# Altium project CH32V003F4P6_ControlRelay.PrjPcb
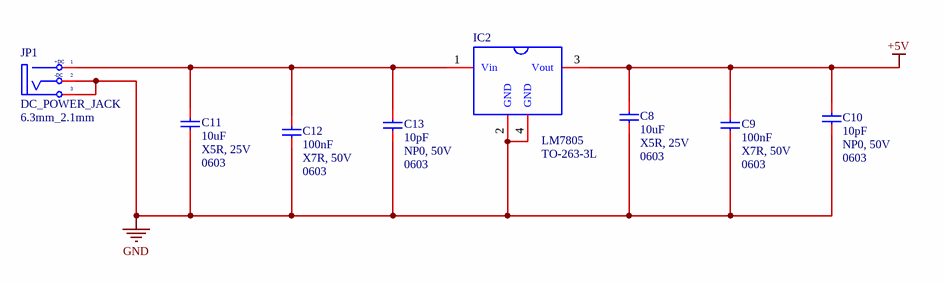
[diagram p0: POWER_SUPPLY.SchDoc]
5 sheets, 62 parts. Net scope: global (net labels, ports and power ports of the same name join across sheets).
Board files: PCB_V1.0.PcbDoc, Multi_Board_V1.0.PcbDoc
Sheets:
  REVISION_HISTORY.SchDoc
  POWER_SUPPLY.SchDoc
  MCU.SchDoc
  DS1307.SchDoc
  RELAY.SchDoc

## Sheet REVISION_HISTORY.SchDoc: REVISIONS HISTORY
size A3; SheetNumber: 1; SheetTotal: 5

### Notes on the sheet
- TABLES OF CONTENTS
- REVISION HISTORY
- PAGE
- CONTENTS
- VER#
- DATE
- REVISIONS
- DESCRIPTION OF CHANGES
- AUTHOR
- Author:
- Title:
- Size:
- A3
- Project:
- Revision:
- Modified Date:
- CheckedBy:
- Date:
- SW Version:

## Sheet POWER_SUPPLY.SchDoc: POWER_SUPPLY
size A4; Author: NGUYEN QUANG MINH; Organization: My Company; Address1: Address Line 1; Address2: Address Line 2; Address3: Address Line 3; Address4: Address Line 4; SheetNumber: 2; SheetTotal: 5

### Parts
C8  10uF  Temperature Coefficient: X5R, 25V  Package: 0603  [C0603]
C9  100nF  Temperature Coefficient: X7R, 50V  Package: 0603  [C0603]
C10  10pF  Temperature Coefficient: NP0, 50V  Package: 0603  [C0603]
C11  10uF  Temperature Coefficient: X5R, 25V  Package: 0603  [C0603]
C12  100nF  Temperature Coefficient: X7R, 50V  Package: 0603  [C0603]
C13  10pF  Temperature Coefficient: NP0, 50V  Package: 0603  [C0603]
IC2  LM7805  [TO-263-3L]
JP1  DC_POWER_JACK  Reference: 6.3mm_2.1mm  [DC_POWER_JACK_6.3mm_2.1mm]

### Nets
+5V: C8.2 C9.2 C10.2 IC2.3(Vout)
GND: C8.1 C9.1 C10.1 C11.1 C12.1 C13.1 IC2.2(GND) IC2.4(GND) JP1.2(TN) JP1.3(S)
NetC11_2: C11.2 C12.2 C13.2 IC2.1(Vin) JP1.1(T)

### Notes on the sheet
- Author:
- Title:
- Size:
- A4
- Project:
- Approved:
- Revision:
- Modified Date:
- CONFIDENTIAL
- Date:
- SW Version:
- (in symbol DC_POWER_JACK_6.3mm_2.1mm) +DC; -DC

### Library data of the parts
C8 C11 = C0603_MLCC_10uF_X5R_25V: 25V 10uF X5R ±20% 0603 Multilayer Ceramic Capacitors MLCC - SMD/SMT ROHS; Manufacturer: YAGEO; Mfr. Part: CC0603MRX5R8BB106; LCSC Part: C596327; Capacitance: 10uF; Link: https://www.lcsc.com/product-detail/C596327.html; Tolerance: ±20%; Voltage Rating: 25V
C9 C12 = C0603_MLCC_100nF_X7R_50V: 50V 100nF X7R ±10% 0603 Multilayer Ceramic Capacitors MLCC - SMD/SMT ROHS; Manufacturer: YAGEO; Mfr. Part: CC0603KRX7R9BB104; LCSC Part: C14663; Capacitance: 100nF; Link: https://www.lcsc.com/product-detail/C14663.html; Tolerance: ±10%; Voltage Rating: 50V
C10 C13 = C0603_MLCC_10pF_NP0_50V: 50V 10pF NP0 ±5% 0603 Multilayer Ceramic Capacitors MLCC - SMD/SMT ROHS; Manufacturer: YAGEO; Mfr. Part: CC0603JRNPO9BN100; LCSC Part: C106245; Capacitance: 10pF; Link: https://www.lcsc.com/product-detail/C106245.html; Tolerance: ±5%; Voltage Rating: 50V
IC2 = LM7805_TO-263-3L: 62dB@(120Hz) 1A Fixed 4.8V~5.2V Positive 35V TO-263-3L Voltage Regulators - Linear, Low Drop Out (LDO) Regulators ROHS; Manufacturer: HANSCHIP semiconductor; Mfr. Part: LM7805SRG; Number of Outputs: 1; LCSC Part: C5145372; Link: https://www.lcsc.com/product-detail/C5145372.html?s_z=n_lm7805; Category: Power Management (PMIC)/Voltage Regulators - Linear, Low Drop Out (LDO) Regulators; Output Current: 1A; Output Voltage: 4.8V~5.2V; Output Configuration: Positive; Operating Temperature: -40℃~+85℃@(Ta); Voltage - Supply: 35V; Package: TO-263-3L
JP1 = DC_POWER_JACK_6.3mm_2.1mm: Right Angle DC Power Jack -40℃~+85℃ 2.1mm 6.3mm 3A 500V Through Hole DC Power Connectors ROHS; Manufacturer: Lian Xin Technology; Mfr. Part: XDJK-0051-025; LCSC Part: C7498153; Package: Through Hole; Current Rating-Power: 3A; Link: https://www.lcsc.com/product-detail/C7498153.html?s_z=n_XDJK-0051-025; Connector Type: DC Power Jack; Operating Temperature: -40℃~+85℃; Inside Contact Diameter: 2.1mm; Outside Contact Diameter: 6.3mm; Current Rating: 3A; Voltage Rating (Max): 500V

## Sheet MCU.SchDoc: MCU
size A4; Author: NGUYEN QUANG MINH; Organization: My Company; Address1: Address Line 1; Address2: Address Line 2; Address3: Address Line 3; Address4: Address Line 4; SheetNumber: 3; SheetTotal: 5
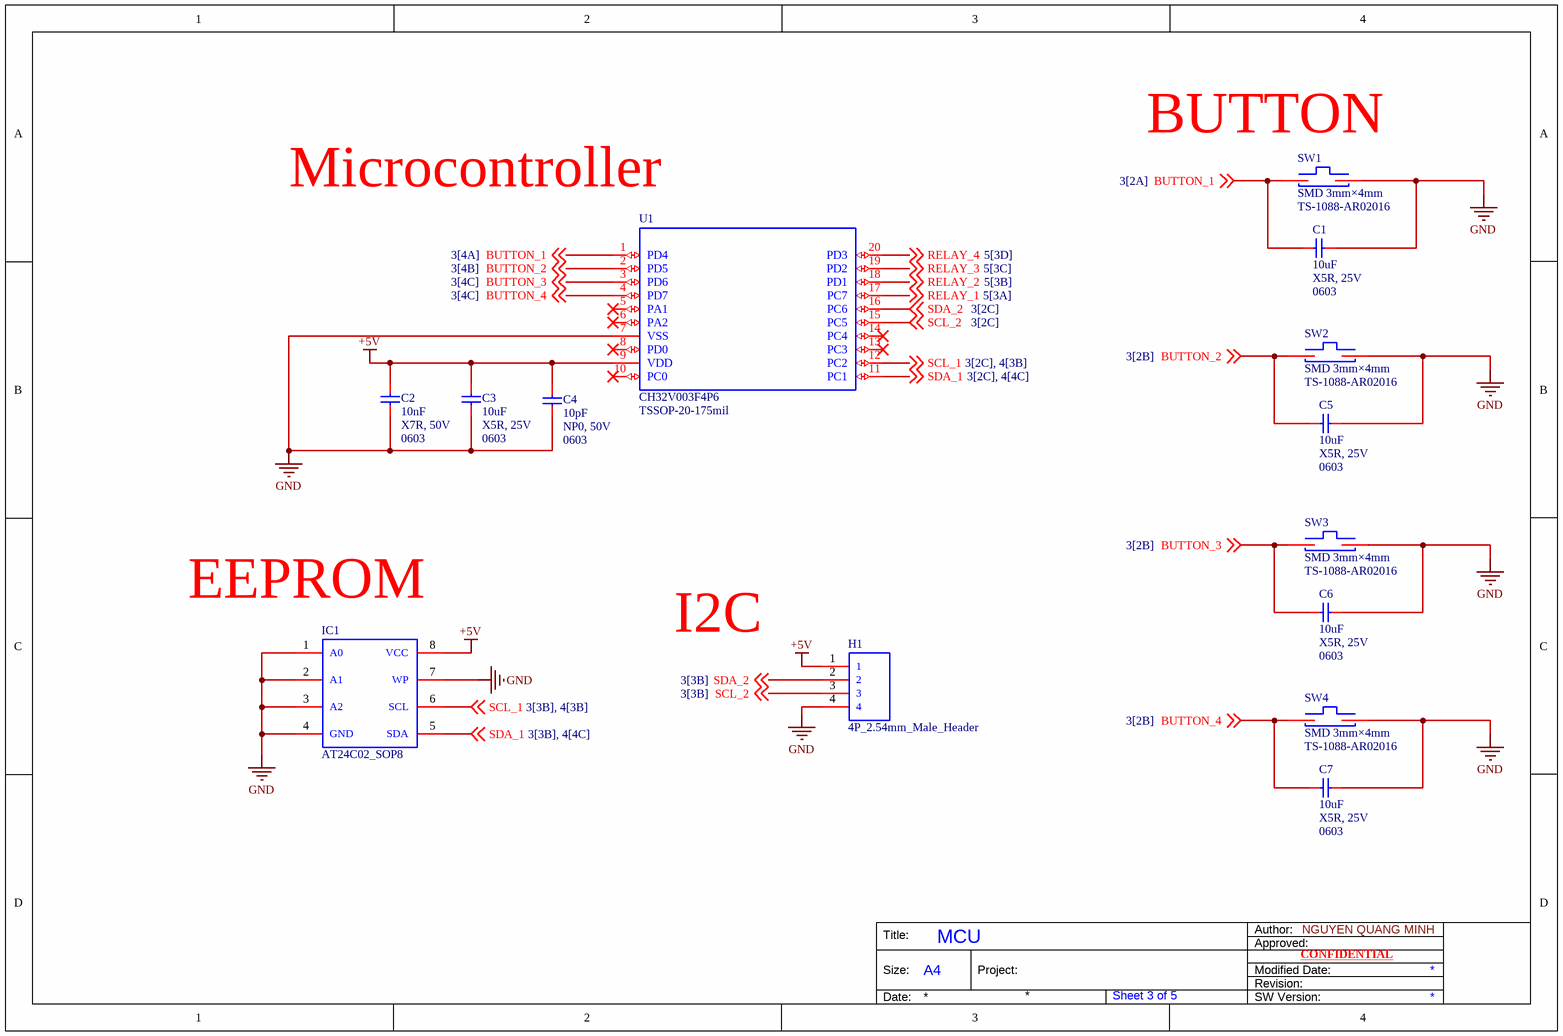
[diagram p1: MCU.SchDoc]

### Parts
C1  10uF  Temperature Coefficient: X5R, 25V  Package: 0603  [C0603]
C2  10nF  Temperature Coefficient: X7R, 50V  Package: 0603  [C0603]
C3  10uF  Temperature Coefficient: X5R, 25V  Package: 0603  [C0603]
C4  10pF  Temperature Coefficient: NP0, 50V  Package: 0603  [C0603]
C5  10uF  Temperature Coefficient: X5R, 25V  Package: 0603  [C0603]
C6  10uF  Temperature Coefficient: X5R, 25V  Package: 0603  [C0603]
C7  10uF  Temperature Coefficient: X5R, 25V  Package: 0603  [C0603]
H1  4P_2.54mm_Male_Header  [4P, 2,54mm, MALE HEADER]
IC1  AT24C02_SOP8  [SOP-8]
SW1  SMD 3mm×4mm  Mfr. Part: TS-1088-AR02016  [ROUND_BUTTON_SMD 3*4mm]
SW2  SMD 3mm×4mm  Mfr. Part: TS-1088-AR02016  [ROUND_BUTTON_SMD 3*4mm]
SW3  SMD 3mm×4mm  Mfr. Part: TS-1088-AR02016  [ROUND_BUTTON_SMD 3*4mm]
SW4  SMD 3mm×4mm  Mfr. Part: TS-1088-AR02016  [ROUND_BUTTON_SMD 3*4mm]
U1  CH32V003F4P6  Package: TSSOP-20-175mil  [TSSOP-20]

### Nets
+5V: C2.2 C3.2 C4.2 H1.1 IC1.8(VCC) U1.9(VDD)
GND: C1.2 C2.1 C3.1 C4.1 C5.2 C6.2 C7.2 H1.4 IC1.1(A0) IC1.2(A1) IC1.3(A2) IC1.4(GND) IC1.7(WP) SW1.2 SW2.2 SW3.2 SW4.2 U1.7(VSS)
BUTTON_1: C1.1 SW1.1 U1.1(PD4) ; off-sheet BUTTON_1
BUTTON_2: C5.1 SW2.1 U1.2(PD5) ; off-sheet BUTTON_2
BUTTON_3: C6.1 SW3.1 U1.3(PD6) ; off-sheet BUTTON_3
BUTTON_4: C7.1 SW4.1 U1.4(PD7) ; off-sheet BUTTON_4
RELAY_1: U1.17(PC7) ; off-sheet RELAY_1
RELAY_2: U1.18(PD1) ; off-sheet RELAY_2
RELAY_3: U1.19(PD2) ; off-sheet RELAY_3
RELAY_4: U1.20(PD3) ; off-sheet RELAY_4
SCL_1: IC1.6(SCL) U1.12(PC2) ; off-sheet SCL_1
SCL_2: H1.3 U1.15(PC5) ; off-sheet SCL_2
SDA_1: IC1.5(SDA) U1.11(PC1) ; off-sheet SDA_1
SDA_2: H1.2 U1.16(PC6) ; off-sheet SDA_2

Not connected (* = marked no-connect by the designer): U1 5(PA1)* 6(PA2)* 8(PD0)* 10(PC0)* 13(PC3)* 14(PC4)*

### Notes on the sheet
- (near SW1) BUTTON
- Microcontroller
- (near IC1) EEPROM
- I2C
- Author:
- Title:
- Size:
- A4
- Project:
- Approved:
- Revision:
- Modified Date:
- CONFIDENTIAL
- Date:
- SW Version:

### Library data of the parts
C1 C3 C5-C7 = C0603_MLCC_10uF_X5R_25V: as C8 on sheet POWER_SUPPLY; LCSC Part: C596327; Capacitance: 10uF; Link: https://www.lcsc.com/product-detail/C596327.html; Tolerance: ±20%; Voltage Rating: 25V
C2 = C0603_MLCC_10nF_X7R_50V: 50V 10nF X7R ±10% 0603 Multilayer Ceramic Capacitors MLCC - SMD/SMT ROHS; Manufacturer: YAGEO; Mfr. Part: CC0603KRX7R9BB103; LCSC Part: C100042; Capacitance: 10nF; Link: https://www.lcsc.com/product-detail/C100042.html; Tolerance: ±10%; Voltage Rating: 50V
C4 = C0603_MLCC_10pF_NP0_50V: as C10 on sheet POWER_SUPPLY; LCSC Part: C106245; Capacitance: 10pF; Link: https://www.lcsc.com/product-detail/C106245.html; Tolerance: ±5%; Voltage Rating: 50V
H1 = 4P_2.54mm_Male_Header: 4P 1x4P -40℃~+105℃ Black Pin Header 2.54mm 2.5mm 6mm 250V 3mm 1 Through Hole Through Hole,P=2.54mm Headers, Male Pins ROHS; Manufacturer: XFCN; Mfr. Part: PZ254V-11-04P; LCSC Part: C2691448; Package: Through Hole,P=2.54mm; Holes Structure: 1x4P; Link: https://www.lcsc.com/product-detail/C2691448.html; Pitch: 2.54mm
IC1 = AT24C02_SOP8: 2Kbit 1.8V~5.5V 1MHz I2C SOP-8 Memory (ICs) ROHS; Manufacturer: IDCHIP; Key Attributes: 24C02 2K-bit Electrically Erasable PROM; Data Retention - TDR (Year): 100 Years; Write Cycle Time(tWC): 5ms; Write Cycle Endurance: 1,000,000 Cycles; Mfr. Part: AT24C02; LCSC Part: C688857; Package: SOP-8; Memory Size: 2Kbit; Voltage - Supply: 1.8V~5.5V; Clock Frequency: 1MHz; Operating Temperature: -40℃~+85℃; Interface: I2C; Link: https://www.lcsc.com/product-detail/C688857.html?s_z=n_AT24C02%2520-%2520TSSOP8
SW1-SW4 = SW_BUTTON_SMD_3mm×4mm: Without Bracket 50mA 4mm 100,000 Cycles 12V 1.6N 3mm 2mm Round Button Surface Mount,Vertical SPST SMD Tactile Switches ROHS; Manufacturer: XUNPU; LCSC Part: C720477; Package: SMD; Length: 4mm; Width: 3mm; Voltage Rating: 12V; Operating Temperature: -30℃~+80℃; Link: https://www.lcsc.com/product-detail/C720477.html?s_z=n_Button
U1 = CH32V003F4P6_TSSOP-20-175mil: TSSOP-20-175mil Microcontrollers (MCU/MPU/SOC) ROHS; Manufacturer: WCH; Mfr. Part: CH32V003F4P6; LCSC Part: C5187096; Link: https://www.lcsc.com/product-detail/C5187096.html?s_z=n_CH32V003F4P6

## Sheet DS1307.SchDoc
size A4; Organization: My Company; Address1: Address Line 1; Address2: Address Line 2; Address3: Address Line 3; Address4: Address Line 4; SheetNumber: 4; SheetTotal: 5
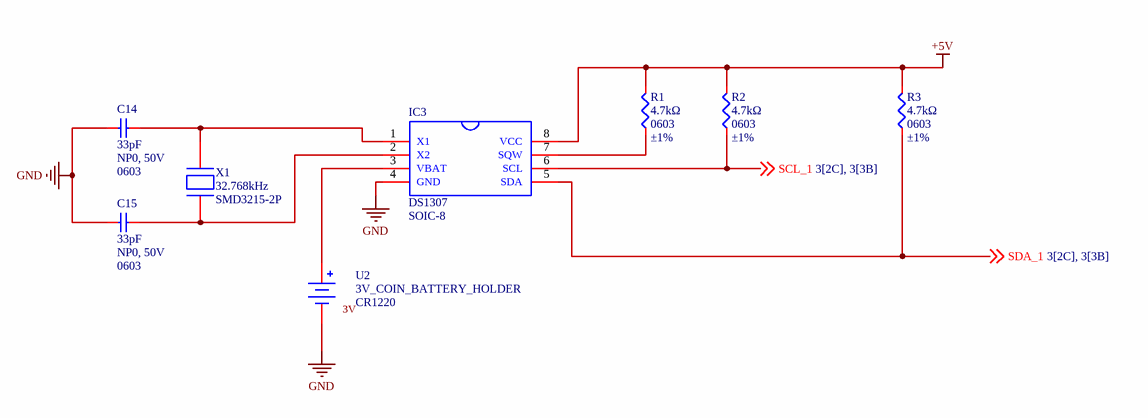
[diagram p2: DS1307.SchDoc]

### Parts
C14  33pF  Temperature Coefficient: NP0, 50V  Package: 0603  [C0603]
C15  33pF  Temperature Coefficient: NP0, 50V  Package: 0603  [C0603]
IC3  DS1307  [SOIC-8]
R1  4.7kΩ  Package: 0603  Tolerance: ±1%  [R0603]
R2  4.7kΩ  Package: 0603  Tolerance: ±1%  [R0603]
R3  4.7kΩ  Package: 0603  Tolerance: ±1%  [R0603]
U2  3V_COIN_BATTERY_HOLDER  Battery Type: CR1220  [3V_COIN_BATERRY_HOLDER_CR1220]
X1  32.768kHz  [SMD3215-2P]

### Nets
+5V: IC3.8(VCC) R1.2 R2.2 R3.2
GND: C14.2 C15.2 IC3.4(GND) U2.2
SCL_1: IC3.6(SCL) R2.1 ; off-sheet SCL_1
SDA_1: IC3.5(SDA) R3.1 ; off-sheet SDA_1
NetC14_1: C14.1 IC3.1(X1) X1.2
NetC15_1: C15.1 IC3.2(X2) X1.1
NetIC3_3: IC3.3(VBAT) U2.1
NetIC3_7: IC3.7(SQW) R1.1

### Notes on the sheet
- Author:
- Title:
- Size:
- A4
- Project:
- Approved:
- Revision:
- Modified Date:
- CONFIDENTIAL
- Date:
- SW Version:
- (in symbol 3V_COIN_BATTERY_HOLDER) 3V

### Library data of the parts
C14 C15 = C0603_MLCC_33pF_NP0_50V: 50V 33pF NP0 ±5% 0603 Multilayer Ceramic Capacitors MLCC - SMD/SMT ROHS; Manufacturer: YAGEO; Mfr. Part: CC0603JRNPO9BN330; LCSC Part: C107047; Capacitance: 33pF; Link: https://www.lcsc.com/product-detail/C107047.html; Tolerance: ±5%; Voltage Rating: 50V
IC3 = DS1307-SOIC8: I2C SOIC-8 Real Time Clocks ROHS; Manufacturer: MAXIM; Mfr. Part: DS1307Z+T&R; Key Attributes: 64 x 8, Serial, I²C Real-Time Clock; LCSC Part: C9868; Link: https://www.lcsc.com/product-detail/C9868.html?s_z=n_DS1307; Interface: I2C; Package: SOIC-8
R1-R3 = R0603_4.7kΩ_±1%: 100mW Thick Film Resistor 75V ±100ppm/℃ ±1% 4.7kΩ 0603 Chip Resistor - Surface Mount ROHS; Manufacturer: YAGEO; Mfr. Part: RC0603FR-074K7L; LCSC Part: C99782; Resistance: 4.7kΩ; Operating Temperature: -55℃~+155℃; Link: https://www.lcsc.com/product-detail/C99782.html
U2 = 3V_COIN_BATTERY_HOLDER: Battery Holder -25℃~+85℃ Phosphor Bronze CR1220 SMD Button And Strip Battery Connector ROHS; Manufacturer: MYOUNG; Mfr. Part: BS-12-B3AA003; LCSC Part: C964723; Package: SMD; Link: https://www.lcsc.com/product-detail/C964723.html
X1 = Crystal_32.768Khz: 32.768kHz 12.5pF ±20ppm SMD3215-2P Crystals ROHS; Manufacturer: NDK; Mfr. Part: NX3215SA-32.768K-STD-MUA-8; LCSC Part: C156245; Frequency: 32.768kHz; Type: -; Load Capacitance: 12.5pF; Frequency Stability: -; Operating Temperature: -40℃~+85℃; Link: https://www.lcsc.com/product-detail/C156245.html?s_z=n_Crystal%252032%252C768kHz; Package: SMD3215-2P

## Sheet RELAY.SchDoc
size A3; Organization: My Company; Address1: Address Line 1; Address2: Address Line 2; Address3: Address Line 3; Address4: Address Line 4; SheetNumber: 5; SheetTotal: 5
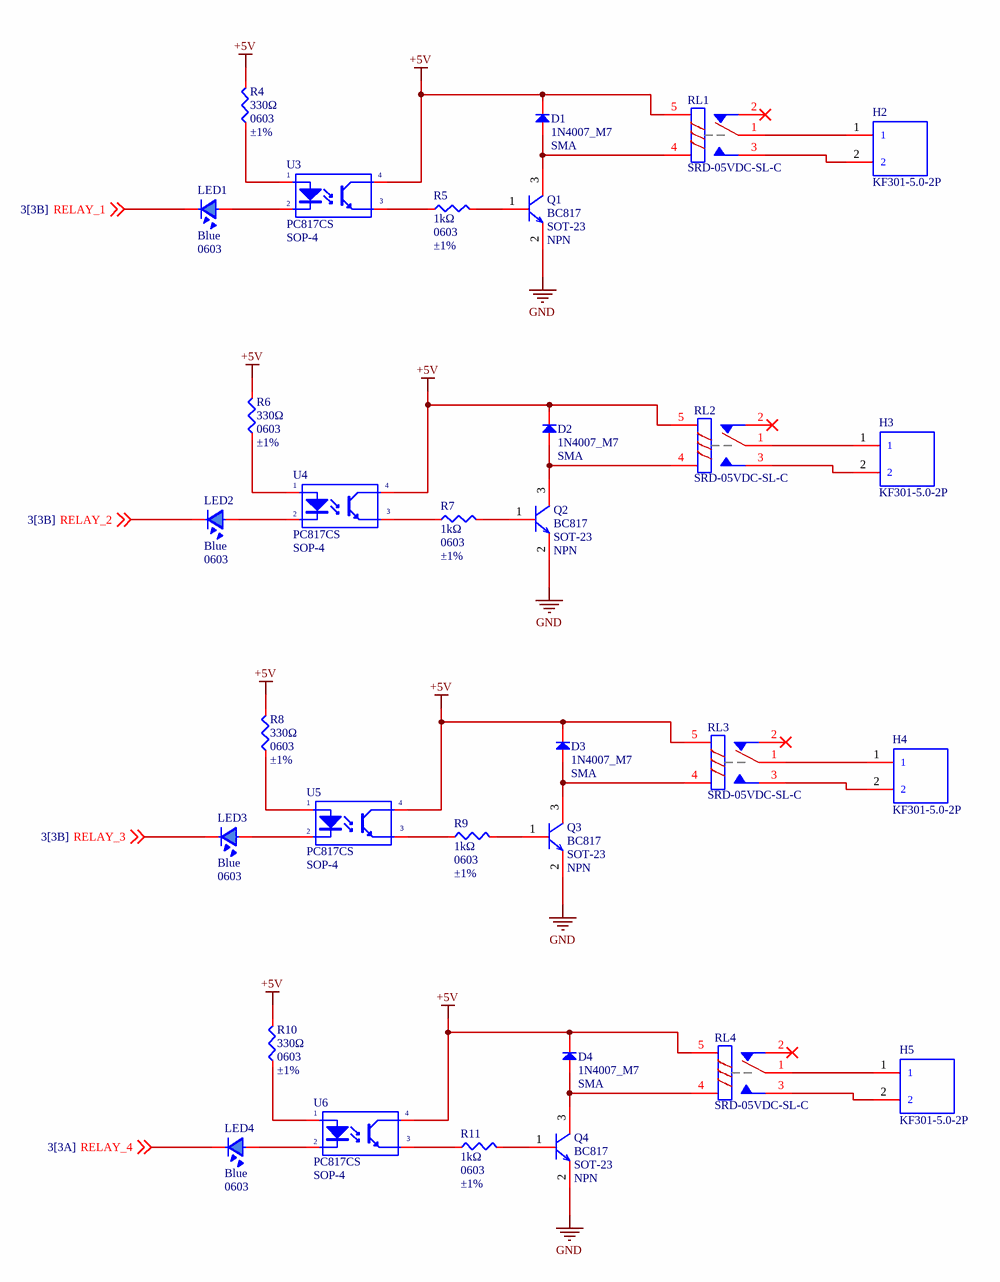
[diagram p3: RELAY.SchDoc]

### Parts
D1  1N4007_M7  Package: SMA  [SMA(DO-214AC)]
D2  1N4007_M7  Package: SMA  [SMA(DO-214AC)]
D3  1N4007_M7  Package: SMA  [SMA(DO-214AC)]
D4  1N4007_M7  Package: SMA  [SMA(DO-214AC)]
H2  KF301-5.0-2P  [CONN-TH_P5.00_KF301-5.0-2P]
H3  KF301-5.0-2P  [CONN-TH_P5.00_KF301-5.0-2P]
H4  KF301-5.0-2P  [CONN-TH_P5.00_KF301-5.0-2P]
H5  KF301-5.0-2P  [CONN-TH_P5.00_KF301-5.0-2P]
LED1  Blue  Package: 0603  [LED0603_BLUE]
LED2  Blue  Package: 0603  [LED0603_BLUE]
LED3  Blue  Package: 0603  [LED0603_BLUE]
LED4  Blue  Package: 0603  [LED0603_BLUE]
Q1  BC817  Type: NPN  [SOT-23]
Q2  BC817  Type: NPN  [SOT-23]
Q3  BC817  Type: NPN  [SOT-23]
Q4  BC817  Type: NPN  [SOT-23]
R4  330Ω  Package: 0603  Tolerance: ±1%  [R0603]
R5  1kΩ  Package: 0603  Tolerance: ±1%  [R0603]
R6  330Ω  Package: 0603  Tolerance: ±1%  [R0603]
R7  1kΩ  Package: 0603  Tolerance: ±1%  [R0603]
R8  330Ω  Package: 0603  Tolerance: ±1%  [R0603]
R9  1kΩ  Package: 0603  Tolerance: ±1%  [R0603]
R10  330Ω  Package: 0603  Tolerance: ±1%  [R0603]
R11  1kΩ  Package: 0603  Tolerance: ±1%  [R0603]
RL1  SRD-05VDC-SL-C  [Through Hole,15.6x19.2mm]
RL2  SRD-05VDC-SL-C  [Through Hole,15.6x19.2mm]
RL3  SRD-05VDC-SL-C  [Through Hole,15.6x19.2mm]
RL4  SRD-05VDC-SL-C  [Through Hole,15.6x19.2mm]
U3  PC817CS  [SOP-4]
U4  PC817CS  [SOP-4]
U5  PC817CS  [SOP-4]
U6  PC817CS  [SOP-4]

### Nets
+5V: D1.1 D2.1 D3.1 D4.1 R4.2 R6.2 R8.2 R10.2 RL1.5 RL2.5 RL3.5 RL4.5 U3.4(C) U4.4(C) U5.4(C) U6.4(C)
GND: Q1.2(E) Q2.2(E) Q3.2(E) Q4.2(E)
RELAY_1: LED1.2 ; off-sheet RELAY_1
RELAY_2: LED2.2 ; off-sheet RELAY_2
RELAY_3: LED3.2 ; off-sheet RELAY_3
RELAY_4: LED4.2 ; off-sheet RELAY_4
NetD1_2: D1.2 Q1.3(C) RL1.4
NetD2_2: D2.2 Q2.3(C) RL2.4
NetD3_2: D3.2 Q3.3(C) RL3.4
NetD4_2: D4.2 Q4.3(C) RL4.4
NetH2_1: H2.1 RL1.1
NetH2_2: H2.2 RL1.3
NetH3_1: H3.1 RL2.1
NetH3_2: H3.2 RL2.3
NetH4_1: H4.1 RL3.1
NetH4_2: H4.2 RL3.3
NetH5_1: H5.1 RL4.1
NetH5_2: H5.2 RL4.3
NetLED1_1: LED1.1 U3.2(K)
NetLED2_1: LED2.1 U4.2(K)
NetLED3_1: LED3.1 U5.2(K)
NetLED4_1: LED4.1 U6.2(K)
NetQ1_1: Q1.1(B) R5.2
NetQ2_1: Q2.1(B) R7.2
NetQ3_1: Q3.1(B) R9.2
NetQ4_1: Q4.1(B) R11.2
NetR4_1: R4.1 U3.1(A)
NetR5_1: R5.1 U3.3(E)
NetR6_1: R6.1 U4.1(A)
NetR7_1: R7.1 U4.3(E)
NetR8_1: R8.1 U5.1(A)
NetR9_1: R9.1 U5.3(E)
NetR10_1: R10.1 U6.1(A)
NetR11_1: R11.1 U6.3(E)

Not connected (* = marked no-connect by the designer): RL1 2*; RL2 2*; RL3 2*; RL4 2*

### Notes on the sheet
- Author:
- Title:
- Size:
- A3
- Project:
- Revision:
- Modified Date:
- CheckedBy:
- Date:
- SW Version:

### Library data of the parts
D1-D4 = 1N4007_M7: 1A 1V@1A 1kV SMA Diodes - General Purpose ROHS; Manufacturer: JSMSEMI; Mfr. Part: 1N4007 M7; LCSC Part: C20754788; Link: https://www.lcsc.com/product-detail/C20754788.html?s_z=n_1N4007
H2-H5 = KF301-5.0-2P: 1x2P -30℃~+120℃ 17A 250V Blue 14~22 Through Hole 5mm 1.5 1 2 Through Hole,P=5mm Screw Terminal Blocks ROHS; Manufacturer: Cixi Kefa Elec; Mfr. Part: KF301-5.0-2P; LCSC Part: C474881; Package: Through Hole,P=5mm; Category: Connectors/Screw Terminal Blocks; Color: Blue; Link: https://www.lcsc.com/product-detail/C474881.html
LED1-LED4 = LED0603_Blue: 2mA 24mcd Water Clear -40℃~+85℃ 470nm Blue 130° 120mW 2.65V 0603 LED Indication - Discrete ROHS; Manufacturer: Kingbright; Mfr. Part: APT1608LVBC/D; Key Attributes: 1.6 x 0.8 mm SMD Chip LED Lamp; LCSC Part: C5200747; Illumination Color: Blue; Power(Watts): 120mW; Voltage - Forward(Vf): 2.65V; Forward Current: 2mA; Operating Temperature: -40℃~+85℃; Link: https://www.lcsc.com/product-detail/C5200747.html
Q1-Q4 = BC817: 345mW 45V 250@100mA,1V 500mA NPN SOT-23 Single Bipolar Transistors ROHS; Manufacturer: Nexperia; Mfr. Part: BC817-40,215; Transition frequency(fT): 100MHz; Vce Saturation(VCE(sat)): 700mV; LCSC Part: C52801; Pd - Power Dissipation: 345mW; Operating Temperature: -65℃~+150℃; Current - Collector(Ic): 500mA; Link: https://www.lcsc.com/product-detail/C52801.html?s_z=n_NPN; Category: BJT; Package: SOT-23
R4 R6 R8 R10 = R0603_330Ω_±1%: 100mW Thick Film Resistor 75V ±100ppm/℃ ±1% 330Ω 0603 Chip Resistor - Surface Mount ROHS; Manufacturer: YAGEO; Mfr. Part: RC0603FR-07330RL; LCSC Part: C105881; Resistance: 330Ω; Operating Temperature: -55℃~+155℃; Link: https://www.lcsc.com/product-detail/C105881.html
R5 R7 R9 R11 = R0603_1kΩ_±1%: 100mW Thick Film Resistor 75V ±100ppm/℃ ±1% 1kΩ 0603 Chip Resistor - Surface Mount ROHS; Manufacturer: YAGEO; Mfr. Part: RC0603FR-071KL; LCSC Part: C22548; Resistance: 1kΩ; Operating Temperature: -55℃~+155℃; Link: https://www.lcsc.com/product-detail/C22548.html
RL1-RL4 = SRD-05VDC-SL-C: 250V@AC 5V 15A 1 Form C: 1C (SPDT-CO) Through Hole,15.6x19.2mm Power Relays ROHS; Manufacturer: Songle Relay; Mfr. Part: SRD-05VDC-SL-C; LCSC Part: C35449; Package: Through Hole,15.6x19.2mm; Switching Voltage(Max): 250V@AC; Coil Voltage: 5V; Switching Current(Max): 15A; Number of Pins: 5; Link: https://www.lcsc.com/product-detail/C35449.html?s_z=n_relay
U3-U6 = PC817CS: 50mA 200mV@1mA,20mA 80V 6V 1.2V DC SOP-4 Transistor, Photovoltaic Output Optoisolators ROHS; Manufacturer: AOTE; Key Attributes: OPTOISOLATOR 5kV 1CH TRANS SOP-4; Mfr. Part: PC817CS; LCSC Part: C20612591; Category: Isolators/Optocouplers, Optoisolators/Transistor, Photovoltaic Output Optoisolators; Link: https://www.lcsc.com/product-detail/C20612591.html?s_z=n_pc817; Package: SOP-4

## Nets that join several sheets
+5V: POWER_SUPPLY (C8.2 C9.2 C10.2 IC2.3), MCU (6 pins), DS1307 (IC3.8 R1.2 R2.2 R3.2), RELAY (16 pins)
GND: POWER_SUPPLY (10 pins), MCU (18 pins), DS1307 (C14.2 C15.2 IC3.4 U2.2), RELAY (Q1.2 Q2.2 Q3.2 Q4.2)
RELAY_1: MCU (U1.17), RELAY (LED1.2)
RELAY_2: MCU (U1.18), RELAY (LED2.2)
RELAY_3: MCU (U1.19), RELAY (LED3.2)
RELAY_4: MCU (U1.20), RELAY (LED4.2)
SCL_1: MCU (IC1.6 U1.12), DS1307 (IC3.6 R2.1)
SDA_1: MCU (IC1.5 U1.11), DS1307 (IC3.5 R3.1)